# EasyEDA Pro project miniMQ.epro, schematic Keys
Board Name: Keys; Create Date: 2026-08-29; Page Name: P1; Project Name: MagicQ Compact Mini Connect; Schematic Name: Keys; Update Date: 2026-09-19; Company: EasyEDA.com; Page Size: A4; Version: V1.0
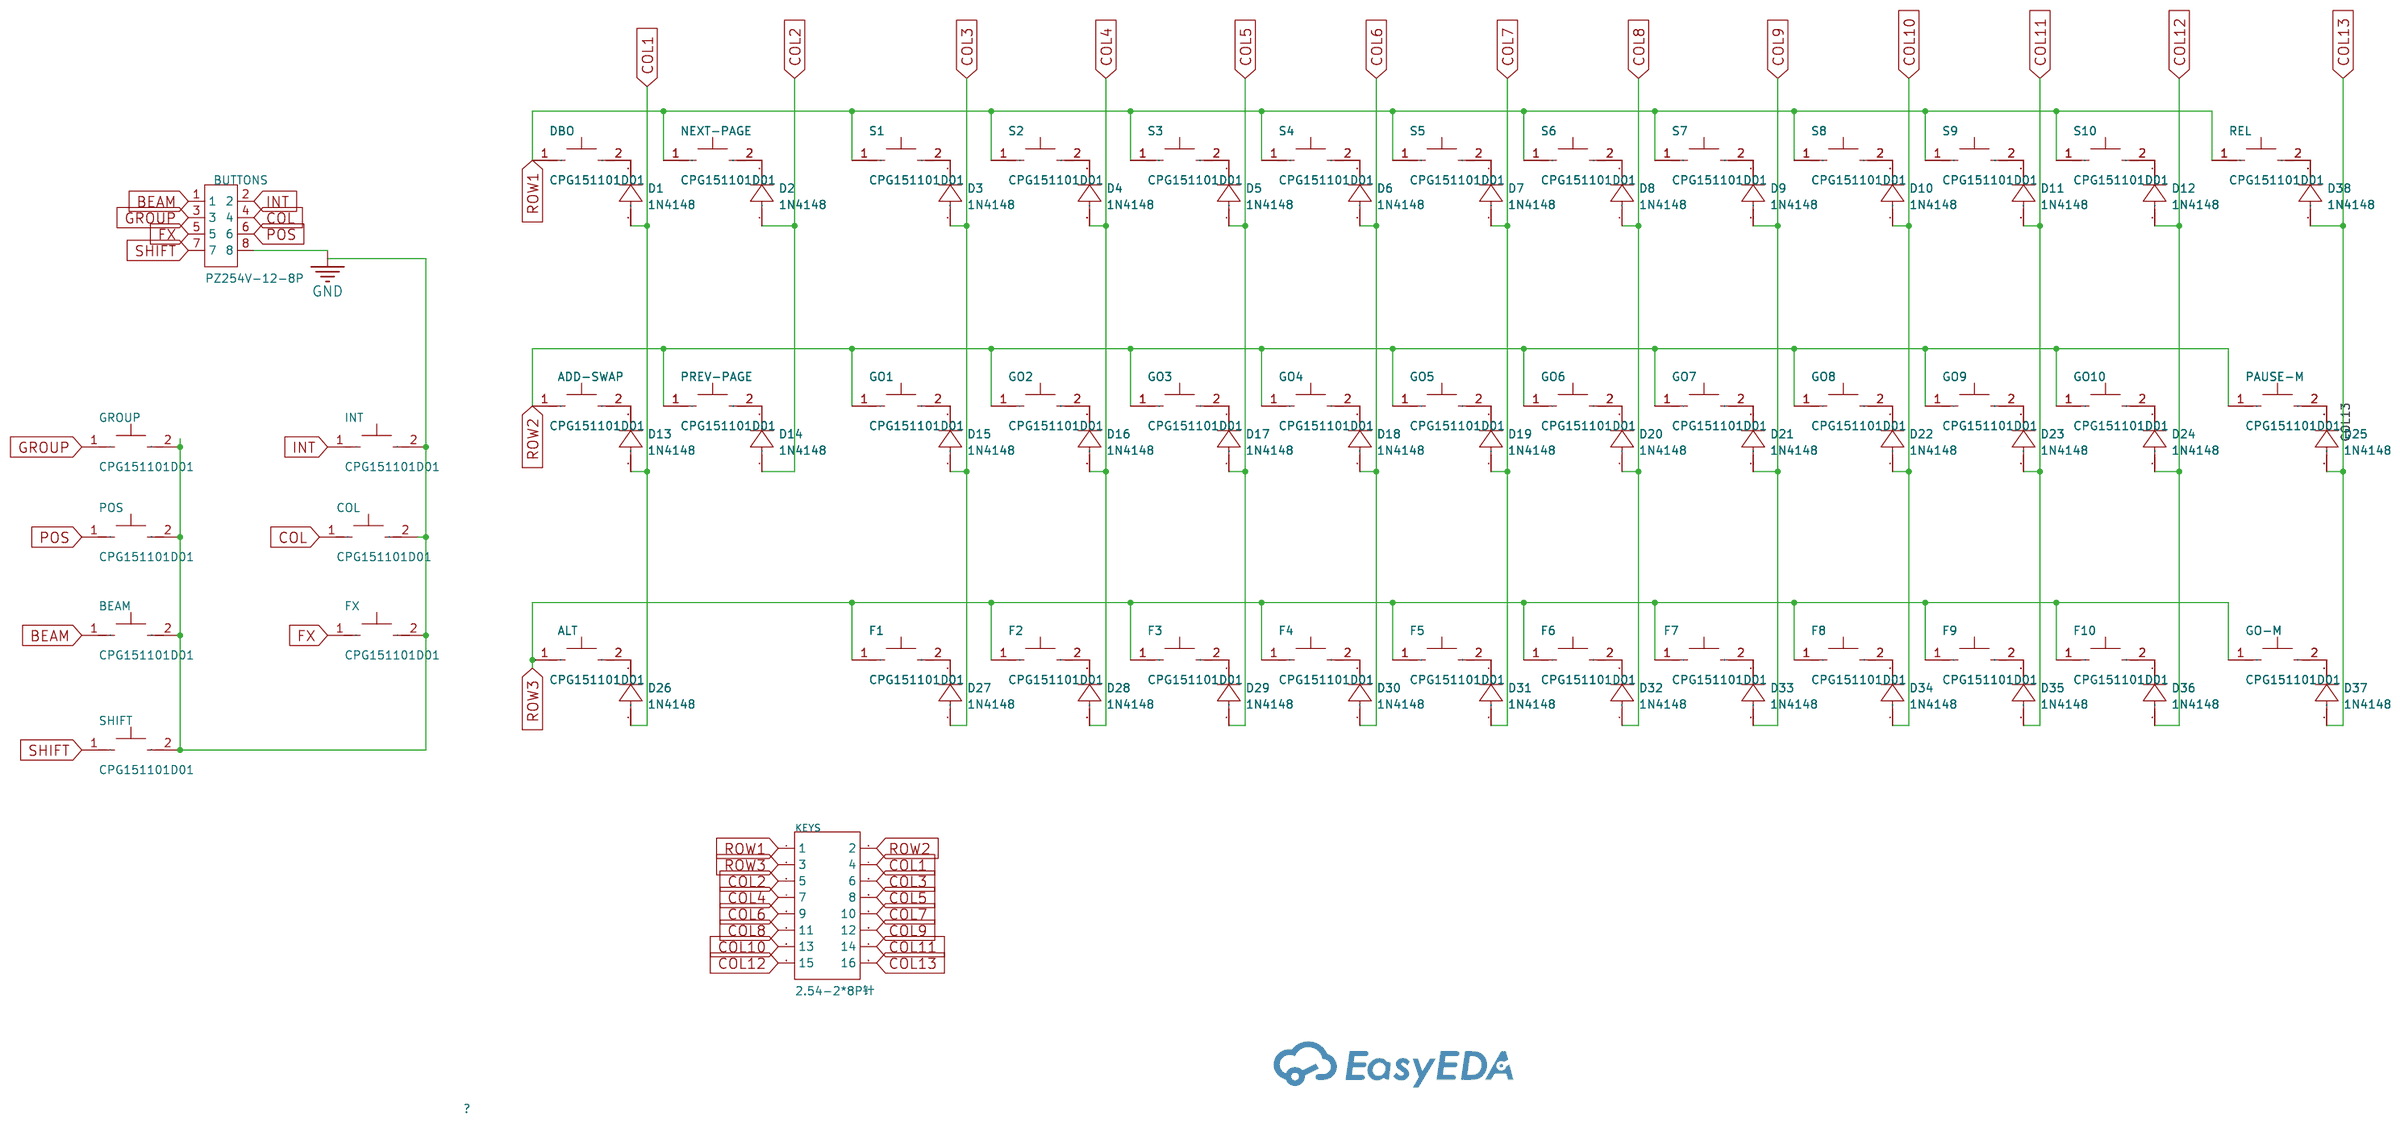
[diagram p6: schematic sheet]

## Parts
ADD-SWAP  CPG151101D01  [SW-TH_CPG151101D9X]
ALT  CPG151101D01  [SW-TH_CPG151101D9X]
BEAM  CPG151101D01  [SW-TH_CPG151101D9X]
BUTTONS  PZ254V-12-8P  [HDR-TH_8P-P2.54-V-M-R2-C4-S2.54]
COL  CPG151101D01  [SW-TH_CPG151101D9X]
D1  1N4148  [DO-35_BD2.2-L4.0-D0.50_1N4148]
D2  1N4148  [DO-35_BD2.2-L4.0-D0.50_1N4148]
D3  1N4148  [DO-35_BD2.2-L4.0-D0.50_1N4148]
D4  1N4148  [DO-35_BD2.2-L4.0-D0.50_1N4148]
D5  1N4148  [DO-35_BD2.2-L4.0-D0.50_1N4148]
D6  1N4148  [DO-35_BD2.2-L4.0-D0.50_1N4148]
D7  1N4148  [DO-35_BD2.2-L4.0-D0.50_1N4148]
D8  1N4148  [DO-35_BD2.2-L4.0-D0.50_1N4148]
D9  1N4148  [DO-35_BD2.2-L4.0-D0.50_1N4148]
D10  1N4148  [DO-35_BD2.2-L4.0-D0.50_1N4148]
D11  1N4148  [DO-35_BD2.2-L4.0-D0.50_1N4148]
D12  1N4148  [DO-35_BD2.2-L4.0-D0.50_1N4148]
D13  1N4148  [DO-35_BD2.2-L4.0-D0.50_1N4148]
D14  1N4148  [DO-35_BD2.2-L4.0-D0.50_1N4148]
D15  1N4148  [DO-35_BD2.2-L4.0-D0.50_1N4148]
D16  1N4148  [DO-35_BD2.2-L4.0-D0.50_1N4148]
D17  1N4148  [DO-35_BD2.2-L4.0-D0.50_1N4148]
D18  1N4148  [DO-35_BD2.2-L4.0-D0.50_1N4148]
D19  1N4148  [DO-35_BD2.2-L4.0-D0.50_1N4148]
D20  1N4148  [DO-35_BD2.2-L4.0-D0.50_1N4148]
D21  1N4148  [DO-35_BD2.2-L4.0-D0.50_1N4148]
D22  1N4148  [DO-35_BD2.2-L4.0-D0.50_1N4148]
D23  1N4148  [DO-35_BD2.2-L4.0-D0.50_1N4148]
D24  1N4148  [DO-35_BD2.2-L4.0-D0.50_1N4148]
D25  1N4148  [DO-35_BD2.2-L4.0-D0.50_1N4148]
D26  1N4148  [DO-35_BD2.2-L4.0-D0.50_1N4148]
D27  1N4148  [DO-35_BD2.2-L4.0-D0.50_1N4148]
D28  1N4148  [DO-35_BD2.2-L4.0-D0.50_1N4148]
D29  1N4148  [DO-35_BD2.2-L4.0-D0.50_1N4148]
D30  1N4148  [DO-35_BD2.2-L4.0-D0.50_1N4148]
D31  1N4148  [DO-35_BD2.2-L4.0-D0.50_1N4148]
D32  1N4148  [DO-35_BD2.2-L4.0-D0.50_1N4148]
D33  1N4148  [DO-35_BD2.2-L4.0-D0.50_1N4148]
D34  1N4148  [DO-35_BD2.2-L4.0-D0.50_1N4148]
D35  1N4148  [DO-35_BD2.2-L4.0-D0.50_1N4148]
D36  1N4148  [DO-35_BD2.2-L4.0-D0.50_1N4148]
D37  1N4148  [DO-35_BD2.2-L4.0-D0.50_1N4148]
D38  1N4148  [DO-35_BD2.2-L4.0-D0.50_1N4148]
DBO  CPG151101D01  [SW-TH_CPG151101D9X]
F1  CPG151101D01  [SW-TH_CPG151101D9X]
F2  CPG151101D01  [SW-TH_CPG151101D9X]
F3  CPG151101D01  [SW-TH_CPG151101D9X]
F4  CPG151101D01  [SW-TH_CPG151101D9X]
F5  CPG151101D01  [SW-TH_CPG151101D9X]
F6  CPG151101D01  [SW-TH_CPG151101D9X]
F7  CPG151101D01  [SW-TH_CPG151101D9X]
F8  CPG151101D01  [SW-TH_CPG151101D9X]
F9  CPG151101D01  [SW-TH_CPG151101D9X]
F10  CPG151101D01  [SW-TH_CPG151101D9X]
FX  CPG151101D01  [SW-TH_CPG151101D9X]
GO1  CPG151101D01  [SW-TH_CPG151101D9X]
GO2  CPG151101D01  [SW-TH_CPG151101D9X]
GO3  CPG151101D01  [SW-TH_CPG151101D9X]
GO4  CPG151101D01  [SW-TH_CPG151101D9X]
GO5  CPG151101D01  [SW-TH_CPG151101D9X]
GO6  CPG151101D01  [SW-TH_CPG151101D9X]
GO7  CPG151101D01  [SW-TH_CPG151101D9X]
GO8  CPG151101D01  [SW-TH_CPG151101D9X]
GO9  CPG151101D01  [SW-TH_CPG151101D9X]
GO10  CPG151101D01  [SW-TH_CPG151101D9X]
GO-M  CPG151101D01  [SW-TH_CPG151101D9X]
GROUP  CPG151101D01  [SW-TH_CPG151101D9X]
INT  CPG151101D01  [SW-TH_CPG151101D9X]
KEYS  2.54-2*8P针  [HDR-TH_16P-P2.54-V-M-R2-C8-S2.54]
NEXT-PAGE  CPG151101D01  [SW-TH_CPG151101D9X]
PAUSE-M  CPG151101D01  [SW-TH_CPG151101D9X]
POS  CPG151101D01  [SW-TH_CPG151101D9X]
PREV-PAGE  CPG151101D01  [SW-TH_CPG151101D9X]
REL  CPG151101D01  [SW-TH_CPG151101D9X]
S1  CPG151101D01  [SW-TH_CPG151101D9X]
S2  CPG151101D01  [SW-TH_CPG151101D9X]
S3  CPG151101D01  [SW-TH_CPG151101D9X]
S4  CPG151101D01  [SW-TH_CPG151101D9X]
S5  CPG151101D01  [SW-TH_CPG151101D9X]
S6  CPG151101D01  [SW-TH_CPG151101D9X]
S7  CPG151101D01  [SW-TH_CPG151101D9X]
S8  CPG151101D01  [SW-TH_CPG151101D9X]
S9  CPG151101D01  [SW-TH_CPG151101D9X]
S10  CPG151101D01  [SW-TH_CPG151101D9X]
SHIFT  CPG151101D01  [SW-TH_CPG151101D9X]

## Library data of the parts
ADD-SWAP ALT BEAM COL DBO F1-F10 FX GO1-GO10 GO-M GROUP INT NEXT-PAGE PAUSE-M POS PREV-PAGE REL S1-S10 SHIFT = CPG151101D01: Axis Type:Black Switch Operation Force:60gf Conduction Travel:2mm Voltage Rating:12V Operating Temperature:-40℃~+70℃ Operating Temperature:-40℃~+70℃; LCSC Part Name: 黑轴; Supplier Part: C49234238; Manufacturer: HanElectricity(瀚源); Supplier Footprint: 插件; JLCPCB Part Class: Extended Part; Datasheet: https://item.szlcsc.com/datasheet/CPG151101D01/51650380.html; Supplier: LCSC; Axis Type: Black Switch; Operation Force: 60gf; Conduction Travel: 2mm; Voltage Rating: 12V; Operating Temperature: -40℃~+70℃
BUTTONS = PZ254V-12-8P: Pin Structure:2x4P Pitch:2.54mm Row Spacing:2.54mm Circluar Pins/Square Pins:Pin Header Mounting Type:Through Hole Number of Rows:2 Number of Pins:8P Current Rating:- Voltage Rating (Max):- Length of Mating Pin:6mm Insulation Height:2.5mm Length of End Co; LCSC Part Name: 2x4P 间距:2.54mm 方针 直插; Supplier Part: C492421; Manufacturer: XFCN(兴飞); Supplier Footprint: 插件,P=2.54mm; JLCPCB Part Class: Extended Part; Datasheet: https://item.szlcsc.com/datasheet/PZ254V-12-8P/502977.html; Supplier: LCSC; Pin Structure: 2x4P; Pitch: 2.54mm; Row Spacing: 2.54mm; Circluar Pins/Square Pins: Pin Header; Mounting Type: Through Hole; Number of Rows: 2; Number of Pins: 8P; Length of Mating Pin: 6mm; Insulation Height: 2.5mm; Length of End Connection Pin: 3mm; Contact Material: Brass; Operating Temperature: -40℃~+105℃; Color: Black
D1-D38 = 1N4148_C18195411: Diode Configuration:1 Independent Pd - Power Dissipation:500mW Current - Rectified:150mA Voltage - DC Reverse(Vr):100V Voltage - Forward(Vf@If):1V@10mA Non-Repetitive Peak Forward Surge Current:500mA Reverse Leakage Current (Ir):5mA Reverse Recovery Time; LCSC Part Name: 100V 150mA; Supplier Part: C18195411; Manufacturer: LJ(朗捷); Supplier Footprint: DO-35; JLCPCB Part Class: Extended Part; Datasheet: https://item.szlcsc.com/datasheet/1N4148/19344798.html; Supplier: LCSC; Diode Configuration: 1 Independent; Pd - Power Dissipation: 500mW; Current - Rectified: 150mA; Voltage - DC Reverse(Vr): 100V; Voltage - Forward(Vf@If): 1V@10mA; Non-Repetitive Peak Forward Surge Current: 500mA; Reverse Leakage Current (Ir): 5mA; Reverse Recovery Time (trr): 4ns; Operating Junction Temperature Range: -60℃~+200℃
KEYS = 2.54-2*8P针_C68234: Pin Structure:2x8P Pitch:2.54mm Row Spacing:2.54mm Circluar Pins/Square Pins:Pin Header Mounting Type:Through Hole Number of Rows:2 Number of Pins:16P Current Rating:3A Voltage Rating (Max):- Length of Mating Pin:5.9mm Insulation Height:2.54mm Length of E; LCSC Part Name: 2x8P 间距:2.54mm 方针 直插; Supplier Part: C68234; Manufacturer: BOOMELE(博穆精密); Supplier Footprint: 插件,P=2.54mm; JLCPCB Part Class: Extended Part; Datasheet: https://item.szlcsc.com/datasheet/2.54-2*8P%25E9%2592%2588/69336.html; Supplier: LCSC; Pin Structure: 2x8P; Pitch: 2.54mm; Row Spacing: 2.54mm; Circluar Pins/Square Pins: Pin Header; Mounting Type: Through Hole; Number of Rows: 2; Number of Pins: 16P; Current Rating: 3A; Length of Mating Pin: 5.9mm; Insulation Height: 2.54mm; Length of End Connection Pin: 3mm; Contact Material: Brass; Contact Plating: Gold; Operating Temperature: -55℃~+105℃; Color: Black

## Nets
GND: BEAM.2 BUTTONS.8 COL.2 FX.2 GROUP.2 INT.2 POS.2 SHIFT.2
BEAM: BEAM.1 BUTTONS.1
COL: BUTTONS.4 COL.1
COL1: D1.1(A) D13.1(A) D26.1(A) KEYS.4
COL2: D2.1(A) D14.1(A) KEYS.5
COL3: D3.1(A) D15.1(A) D27.1(A) KEYS.6
COL4: D4.1(A) D16.1(A) D28.1(A) KEYS.7
COL5: D5.1(A) D17.1(A) D29.1(A) KEYS.8
COL6: D6.1(A) D18.1(A) D30.1(A) KEYS.9
COL7: D7.1(A) D19.1(A) D31.1(A) KEYS.10
COL8: D8.1(A) D20.1(A) D32.1(A) KEYS.11
COL9: D9.1(A) D21.1(A) D33.1(A) KEYS.12
COL10: D10.1(A) D22.1(A) D34.1(A) KEYS.13
COL11: D11.1(A) D23.1(A) D35.1(A) KEYS.14
COL12: D12.1(A) D24.1(A) D36.1(A) KEYS.15
COL13: D25.1(A) D37.1(A) D38.1(A) KEYS.16
FX: BUTTONS.5 FX.1
GROUP: BUTTONS.3 GROUP.1
INT: BUTTONS.2 INT.1
POS: BUTTONS.6 POS.1
ROW1: DBO.1 KEYS.1 NEXT-PAGE.1 REL.1 S1.1 S2.1 S3.1 S4.1 S5.1 S6.1 S7.1 S8.1 S9.1 S10.1
ROW2: ADD-SWAP.1 GO1.1 GO2.1 GO3.1 GO4.1 GO5.1 GO6.1 GO7.1 GO8.1 GO9.1 GO10.1 KEYS.2 PAUSE-M.1 PREV-PAGE.1
ROW3: ALT.1 F1.1 F2.1 F3.1 F4.1 F5.1 F6.1 F7.1 F8.1 F9.1 F10.1 GO-M.1 KEYS.3
SHIFT: BUTTONS.7 SHIFT.1
$1N4077: D3.2(C) S1.2
$1N4118: D4.2(C) S2.2
$1N4159: D5.2(C) S3.2
$1N4200: D6.2(C) S4.2
$1N4241: D7.2(C) S5.2
$1N4282: D8.2(C) S6.2
$1N4323: D9.2(C) S7.2
$1N4364: D10.2(C) S8.2
$1N4405: D11.2(C) S9.2
$1N4446: D12.2(C) S10.2
$1N4487: ADD-SWAP.2 D13.2(C)
$1N4528: D14.2(C) PREV-PAGE.2
$1N4569: D15.2(C) GO1.2
$1N4610: D16.2(C) GO2.2
$1N4651: D17.2(C) GO3.2
$1N4692: D18.2(C) GO4.2
$1N4733: D19.2(C) GO5.2
$1N4774: D20.2(C) GO6.2
$1N4815: D21.2(C) GO7.2
$1N4856: D22.2(C) GO8.2
$1N4897: D23.2(C) GO9.2
$1N4938: D24.2(C) GO10.2
$1N4979: D25.2(C) PAUSE-M.2
$1N5020: ALT.2 D26.2(C)
$1N5061: D27.2(C) F1.2
$1N5102: D28.2(C) F2.2
$1N5143: D29.2(C) F3.2
$1N5184: D30.2(C) F4.2
$1N5225: D31.2(C) F5.2
$1N5266: D32.2(C) F6.2
$1N5307: D33.2(C) F7.2
$1N5348: D34.2(C) F8.2
$1N5389: D35.2(C) F9.2
$1N5430: D36.2(C) F10.2
$1N5471: D37.2(C) GO-M.2
$1N11709: D1.2(C) DBO.2
$1N11737: D2.2(C) NEXT-PAGE.2
$1N17109: D38.2(C) REL.2
